# EAGLE design brain (EAGLE 9.7.0)
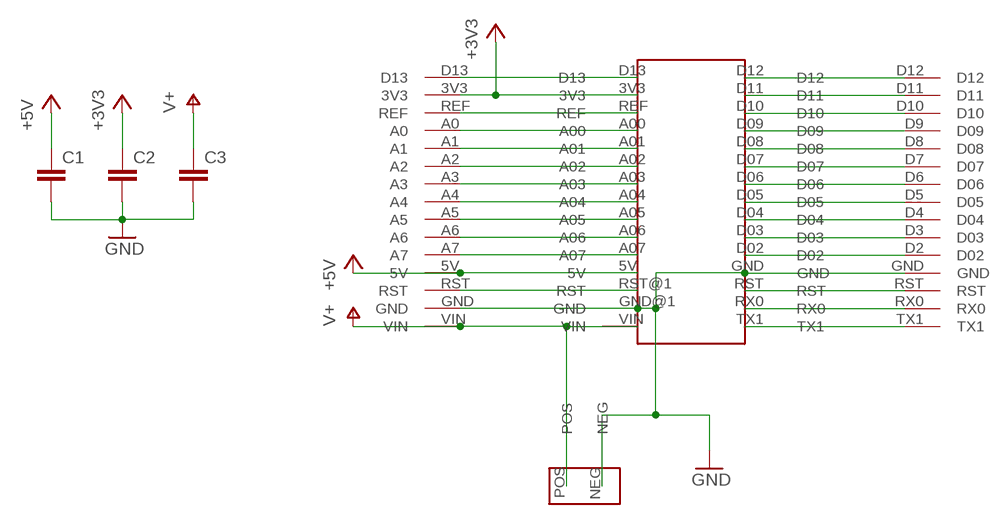
[diagram p0: schematic, sheet 1]

## Parts
C1  C-EU050-025X075  [C050-025X075]
C2  C-EU050-025X075  [C050-025X075]
C3  C-EU050-025X075  [C050-025X075]
U$1  ARDUINO-NANO-V3  [ARDUINO-NANO-V3]
U$2  ARDUINO-NANO-JUMPER-1  [ARDUINO-NANO-JUMPER-1]
U$3  POWER-IN  [POWER-IN]
U$5  ARDUINO-NANO-JUMPER-2  [ARDUINO-NANO-JUMPER-2]

## Nets
+3V3: C2.1 U$1.3V3 U$5.3V3
+5V: C1.1 U$1.5V U$5.5V
A00: U$1.A00 U$5.A0
A01: U$1.A01 U$5.A1
A02: U$1.A02 U$5.A2
A03: U$1.A03 U$5.A3
A04: U$1.A04 U$5.A4
A05: U$1.A05 U$5.A5
A06: U$1.A06 U$5.A6
A07: U$1.A07 U$5.A7
D02: U$1.D02 U$2.D2(D02)
D03: U$1.D03 U$2.D3(D03)
D04: U$1.D04 U$2.D4(D04)
D05: U$1.D05 U$2.D5(D05)
D06: U$1.D06 U$2.D6(D06)
D07: U$1.D07 U$2.D7(D07)
D08: U$1.D08 U$2.D8(D08)
D09: U$1.D09 U$2.D9(D09)
D10: U$1.D10 U$2.D10
D11: U$1.D11 U$2.D11
D12: U$1.D12 U$2.D12
D13: U$1.D13 U$5.D13
GND: C1.2 C2.2 C3.2 U$1.GND U$1.GND@1(GND) U$2.GND U$3.NEG U$5.GND
REF: U$1.REF U$5.REF
RST: U$1.RST U$1.RST@1(RST) U$2.RST U$5.RST
RX0: U$1.RX0 U$2.RX0
TX1: U$1.TX1 U$2.TX1
V+: C3.1 U$1.VIN U$3.POS U$5.VIN

## Library data of the parts
C1-C3 = rcl:C-EU: CAPACITOR, European symbol; SPICEPREFIX: C
U$1 = RC Car:ARDUINO-NANO-V3
U$2 = RC Car:ARDUINO-NANO-JUMPER-1
U$3 = RC Car:POWER-IN
U$5 = RC Car:ARDUINO-NANO-JUMPER-2

## Board
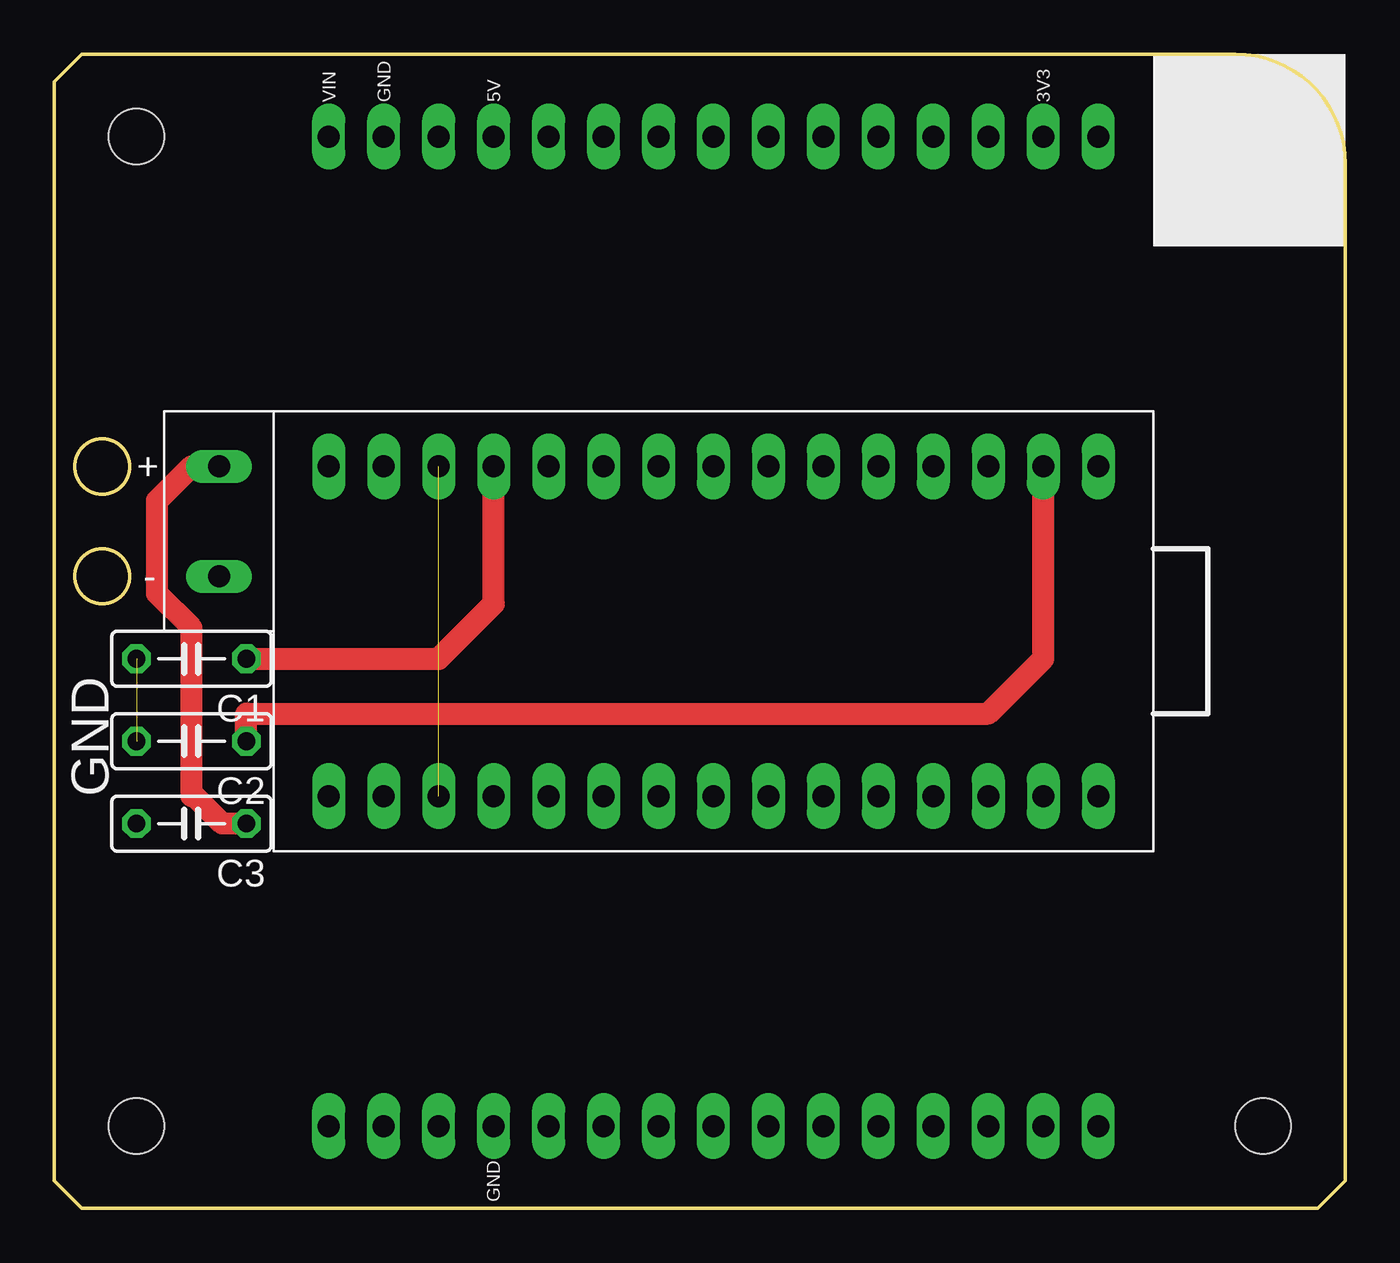
[diagram p1: board, top side]
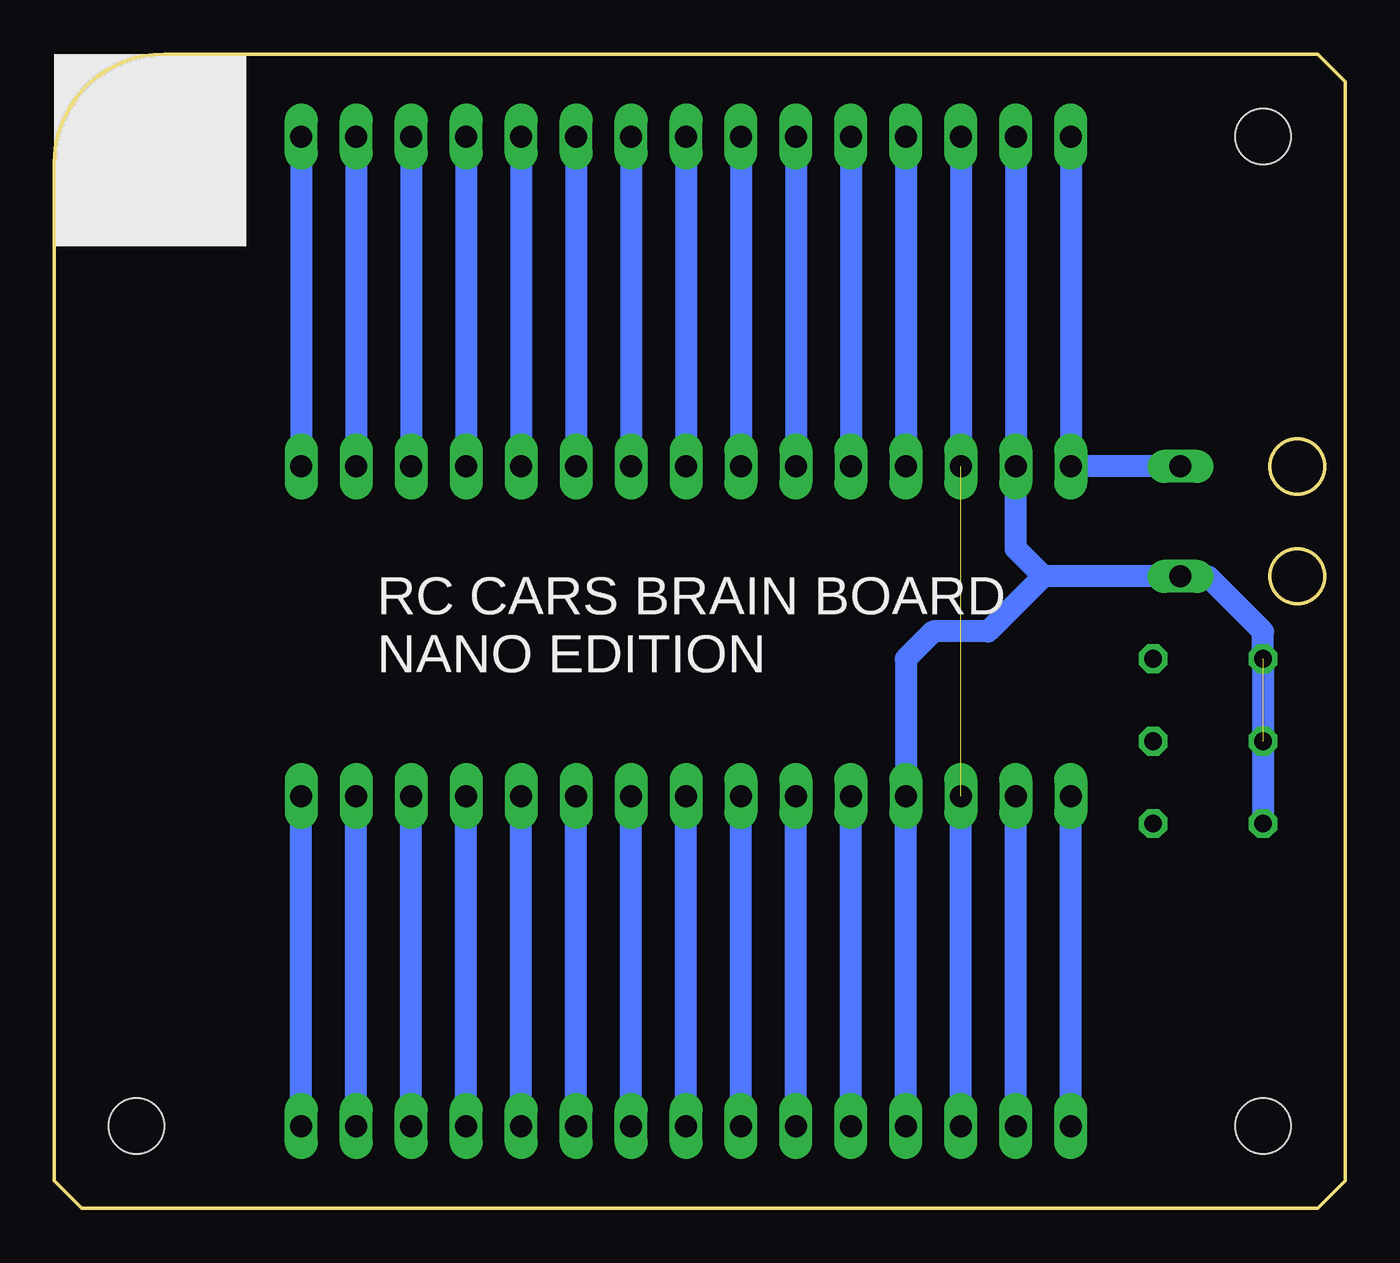
[diagram p2: board, bottom side, seen from below]

Size 59.69 x 53.34 mm. Coordinates in mm from the lower left corner, seen from the top.
Outline: 1.27,53.34 54.61,53.34 arc-90 59.69,48.26 59.69,1.27 58.42,0 1.27,0 0,1.27 0,52.07 1.27,53.34
Outline: circle at 2.22,34.29 radius 1.27
Outline: circle at 2.22,29.21 radius 1.27
Copper layers (1*16): Top 0.035mm / dielectric 1.5mm / Bottom 0.035mm
Design rules "default": minimum track width 6mil, minimum drill 0.35mm, track to track 6mil, track to pad 6mil, pad to pad 6mil, via to via 6mil, smd to smd 6mil, copper to edge 40mil, drill to drill 6mil, minimum pad ring 10mil, minimum via ring 8mil, stop-mask expansion 4mil, vias tented up to drill 0mil, thermal gap 10mil
Holes 2.54 mm at 3.81,49.53 3.81,3.81 55.88,49.53 55.88,3.81

### Footprints (pad centres in the part's own frame; a part is rotated, then mirrored left to right if it is on the bottom)
C050-025X075 = drill 0.813 octagon: 1 -2.54,0; 2 2.54,0
ARDUINO-NANO-V3 = drill 1.016 long: 3V3 -15.24,-15.24; 5V 10.16,-15.24; A00 -10.16,-15.24; A01 -7.62,-15.24; A02 -5.08,-15.24; A03 -2.54,-15.24; A04 0,-15.24; A05 2.54,-15.24; A06 5.08,-15.24; A07 7.62,-15.24; D02 7.62,0; D03 5.08,0; D04 2.54,0; D05 0,0; D06 -2.54,0; D07 -5.08,0; D08 -7.62,0; D09 -10.16,0; D10 -12.7,0; D11 -15.24,0; D12 -17.78,0; D13 -17.78,-15.24; GND 10.16,0; GND@1 15.24,-15.24; REF -12.7,-15.24; RST 12.7,0; RST@1 12.7,-15.24; RX0 15.24,0; TX1 17.78,0; VIN 17.78,-15.24
ARDUINO-NANO-JUMPER-1 = drill 1.016 long: D2 7.62,0; D3 5.08,0; D4 2.54,0; D5 0,0; D6 -2.54,0; D7 -5.08,0; D8 -7.62,0; D9 -10.16,0; D10 -12.7,0; D11 -15.24,0; D12 -17.78,0; GND 10.16,0; RST 12.7,0; RX0 15.24,0; TX1 17.78,0
POWER-IN = drill 1.016 long: NEG 2.54,0; POS -2.54,0
ARDUINO-NANO-JUMPER-2 = drill 1.016 long: 3V3 -15.24,0; 5V 10.16,0; A0 -10.16,0; A1 -7.62,0; A2 -5.08,0; A3 -2.54,0; A4 0,0; A5 2.54,0; A6 5.08,0; A7 7.62,0; D13 -17.78,0; GND 15.24,0; REF -12.7,0; RST 12.7,0; VIN 17.78,0

### Placement (x,y rotation side)
C1  6.35,25.4 180 top
C2  6.35,21.59 180 top
C3  6.35,17.78 180 top
U$1  30.48,19.05 180 top
U$2  30.48,3.81 0 bottom
U$3  7.62,31.75 270 top
U$5  30.48,49.53 0 bottom

### Tracks (layer width: path | path; a pad name or v marks a point on that pad's centre or on a via)
+3V3
  Top 1.016: C2.1 8.89,22.86 43.18,22.86 45.72,25.4 U$1.3V3
  Bottom 1.016: U$5.3V3 U$1.3V3
+5V
  Top 1.016: C1.1 17.78,25.4 20.32,27.94 U$1.5V
  Bottom 1.016: U$5.5V U$1.5V
A00
  Bottom 1.016: U$5.A0 U$1.A00
A01
  Bottom 1.016: U$5.A1 U$1.A01
A02
  Bottom 1.016: U$5.A2 U$1.A02
A03
  Bottom 1.016: U$5.A3 U$1.A03
A04
  Bottom 1.016: U$5.A4 U$1.A04
A05
  Bottom 1.016: U$5.A5 U$1.A05
A06
  Bottom 1.016: U$5.A6 U$1.A06
A07
  Bottom 1.016: U$5.A7 U$1.A07
D02
  Bottom 1.016: U$2.D2 U$1.D02
D03
  Bottom 1.016: U$2.D3 U$1.D03
D04
  Bottom 1.016: U$2.D4 U$1.D04
D05
  Bottom 1.016: U$2.D5 U$1.D05
D06
  Bottom 1.016: U$2.D6 U$1.D06
D07
  Bottom 1.016: U$2.D7 U$1.D07
D08
  Bottom 1.016: U$2.D8 U$1.D08
D09
  Bottom 1.016: U$2.D9 U$1.D09
D10
  Bottom 1.016: U$2.D10 U$1.D10
D11
  Bottom 1.016: U$2.D11 U$1.D11
D12
  Bottom 1.016: U$2.D12 U$1.D12
D13
  Bottom 1.016: U$5.D13 U$1.D13
GND  (1 unrouted)
  Bottom 1.016: U$5.GND U$1.GND@1 15.24,30.48 13.97,29.21 | 13.97,29.21 U$3.NEG 6.35,29.21 3.81,26.67 C1.2 C3.2 | 13.97,29.21 16.51,26.67 19.05,26.67 20.32,25.4 U$1.GND U$2.GND
REF
  Bottom 1.016: U$5.REF U$1.REF
RST  (1 unrouted)
  Bottom 1.016: U$5.RST U$1.RST@1 | U$2.RST U$1.RST
RX0
  Bottom 1.016: U$2.RX0 U$1.RX0
TX1
  Bottom 1.016: U$2.TX1 U$1.TX1
V+
  Top 1.016: C3.1 7.77,17.78 6.5,19.05 6.35,19.05 6.35,26.82 4.76,28.41 4.76,32.7 6.35,34.29 U$3.POS
  Bottom 1.016: U$5.VIN U$1.VIN U$3.POS

### Text on the board
tPlace: VIN | GND | 5V | 3V3 | + | - | GND | GND
bPlace: RC CARS BRAIN BOARD / NANO EDITION